# EasyEDA schematic SCH_Signal Jammer.json
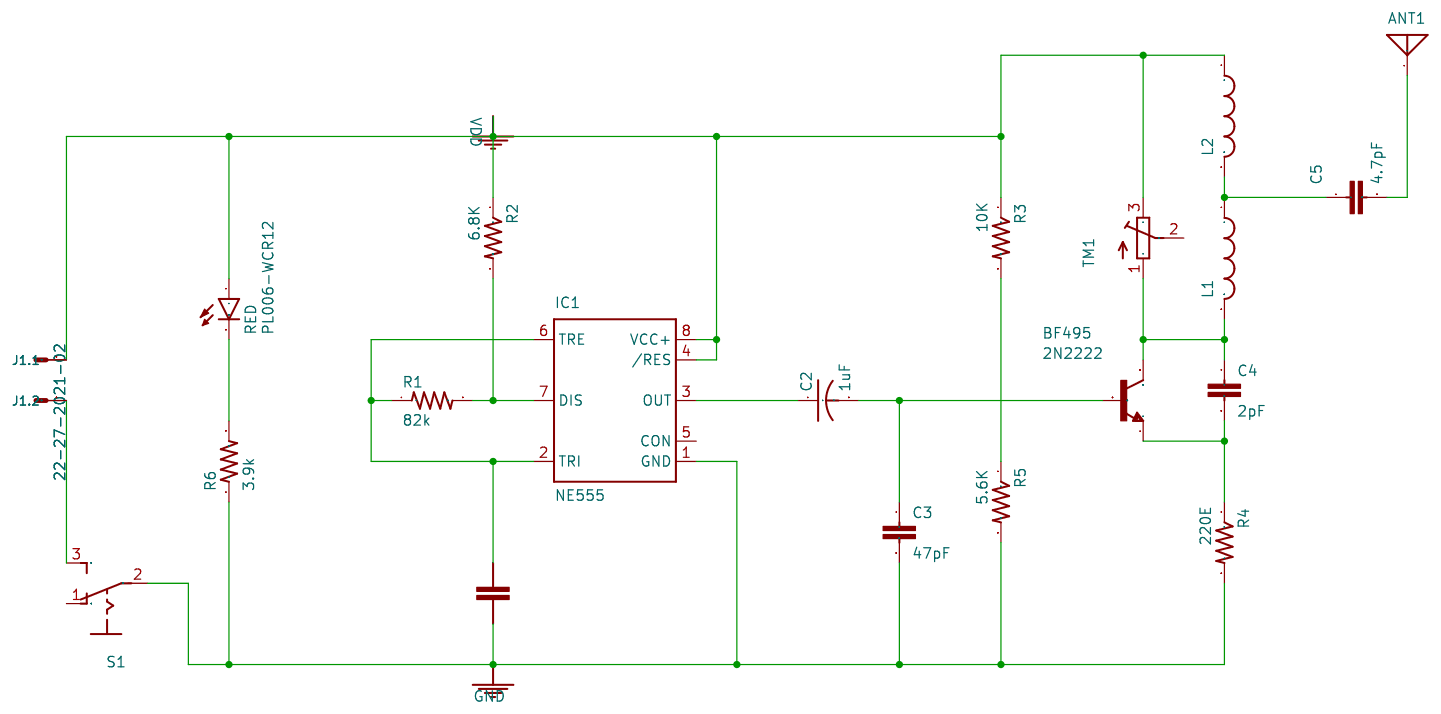
[diagram p0: schematic sheet]

## Parts
ANT1  ANTENNA  [PAD-01]
BF495  2N2222  [TO92-EBC-OVAL]
C1  C
C2  1uF  [C025-025X050]
C3  47pF  [C5B3.5]
C4  2pF  [C5B3.5]
C5  4.7pF  [C5B3.5]
IC1  NE555  [DIL-08]
J1  22-27-2021-02  [6410-02]  (sections 1,2)
L1  L-USTJ4-U1  [TJ4-U1]
L2  L-USTJ4-U1  [TJ4-U1]
R1  82k  [0805-THM]
R2  6.8K  [0805-THM]
R3  10K  [0805-THM]
R4  220E  [0805-THM]
R5  5.6K  [0805-THM]
R6  3.9k  [0805-THM]
RED  PL006-WCR12  [SOT23]
S1  M251  [M251]
TM1  TRIMPOTTC33X  [TC33X]

## Nets
GND: C3.2 IC1.1(GND) R4.2 R5.2 R6.1 S1.2(P)
VDD: IC1.4(/RES) IC1.8(VCC+) J1.1(S) L2.1 R2.1 R3.1 RED.1(A) TM1.3(E)
Net-(ANT1-1): ANT1.1 C5.2
Net-(BF495-B): BF495.B C2.2 C3.1
Net-(BF495-C): BF495.C C4.1 L1.2 TM1.1(A)
Net-(BF495-E): BF495.E C4.2 R4.1
Net-(C2-1): C2.1 IC1.3(OUT)
Net-(C5-1): C5.1 L1.1 L2.2
Net-(IC1-2): IC1.2(TRI) IC1.6(TRE) R1.1
Net-(IC1-7): IC1.7(DIS) R1.2 R2.2
Net-(J1.2-2): J1.2(S) S1.3(S)
Net-(R3-2): R3.2 R5.1
Net-(R6-2): R6.2 RED.3(C)

Not connected (* = marked no-connect by the designer): IC1 5(CON); S1 1(O); TM1 2(S)
